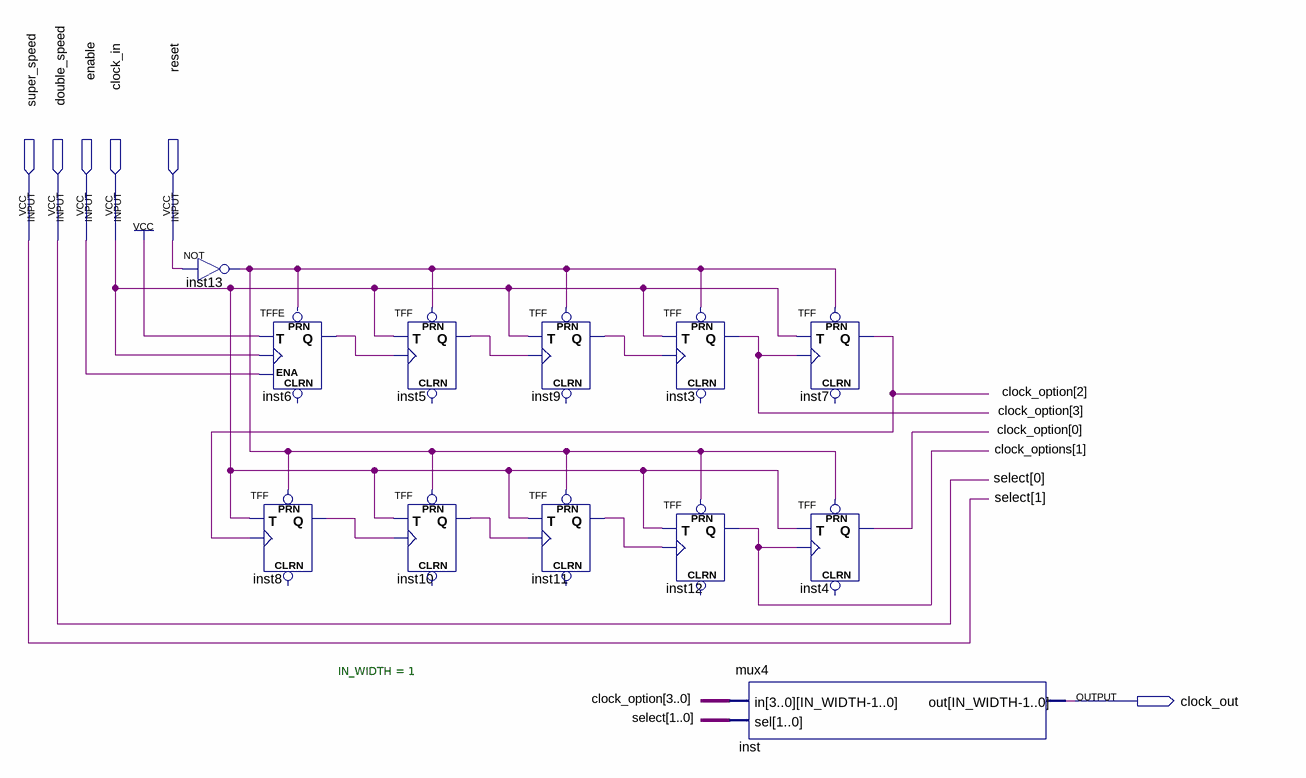
[diagram p0: schematic sheet]
// Quartus schematic delay.bdf as structural Verilog: 12 symbols, 6 pins
module delay (
  input  super_speed,
  input  double_speed,
  input  enable,
  input  clock_in,
  input  reset,
  output clock_out
);

  wire inst5_q, inst6_q, inst8_q, inst9_q, inst10_q, inst11_q, inst13_out;
  wire [1:1] clock_options;
  wire [3:0] clock_option;

  not inst13 (inst13_out, reset);
  TFFE inst6 (.T(1'b1), .CLK(clock_in), .ENA(enable), .PRN(inst13_out), .Q(inst6_q));  // open: CLRN
  TFF inst8 (.PRN(inst13_out), .T(clock_in), .CLK(clock_option[2]), .Q(inst8_q));  // open: CLRN
  TFF inst5 (.PRN(inst13_out), .T(clock_in), .CLK(inst6_q), .Q(inst5_q));  // open: CLRN
  TFF inst10 (.PRN(inst13_out), .T(clock_in), .CLK(inst8_q), .Q(inst10_q));  // open: CLRN
  TFF inst9 (.PRN(inst13_out), .T(clock_in), .CLK(inst5_q), .Q(inst9_q));  // open: CLRN
  TFF inst11 (.PRN(inst13_out), .T(clock_in), .CLK(inst10_q), .Q(inst11_q));  // open: CLRN
  TFF inst3 (.PRN(inst13_out), .T(clock_in), .CLK(inst9_q), .Q(clock_option[3]));  // open: CLRN
  TFF inst12 (.PRN(inst13_out), .T(clock_in), .CLK(inst11_q), .Q(clock_options[1]));  // open: CLRN
  mux4 #(.IN_WIDTH(1)) inst (.in(clock_option), .sel({super_speed, double_speed}), .out(clock_out));
  TFF inst7 (.PRN(inst13_out), .T(clock_in), .CLK(clock_option[3]), .Q(clock_option[2]));  // open: CLRN
  TFF inst4 (.PRN(inst13_out), .T(clock_in), .CLK(clock_options[1]), .Q(clock_option[0]));  // open: CLRN

  // Other names for the same wires on the sheet: select[1:0] = {super_speed, double_speed}
endmodule
